# Altium project EIGHT_29.PrjPcb
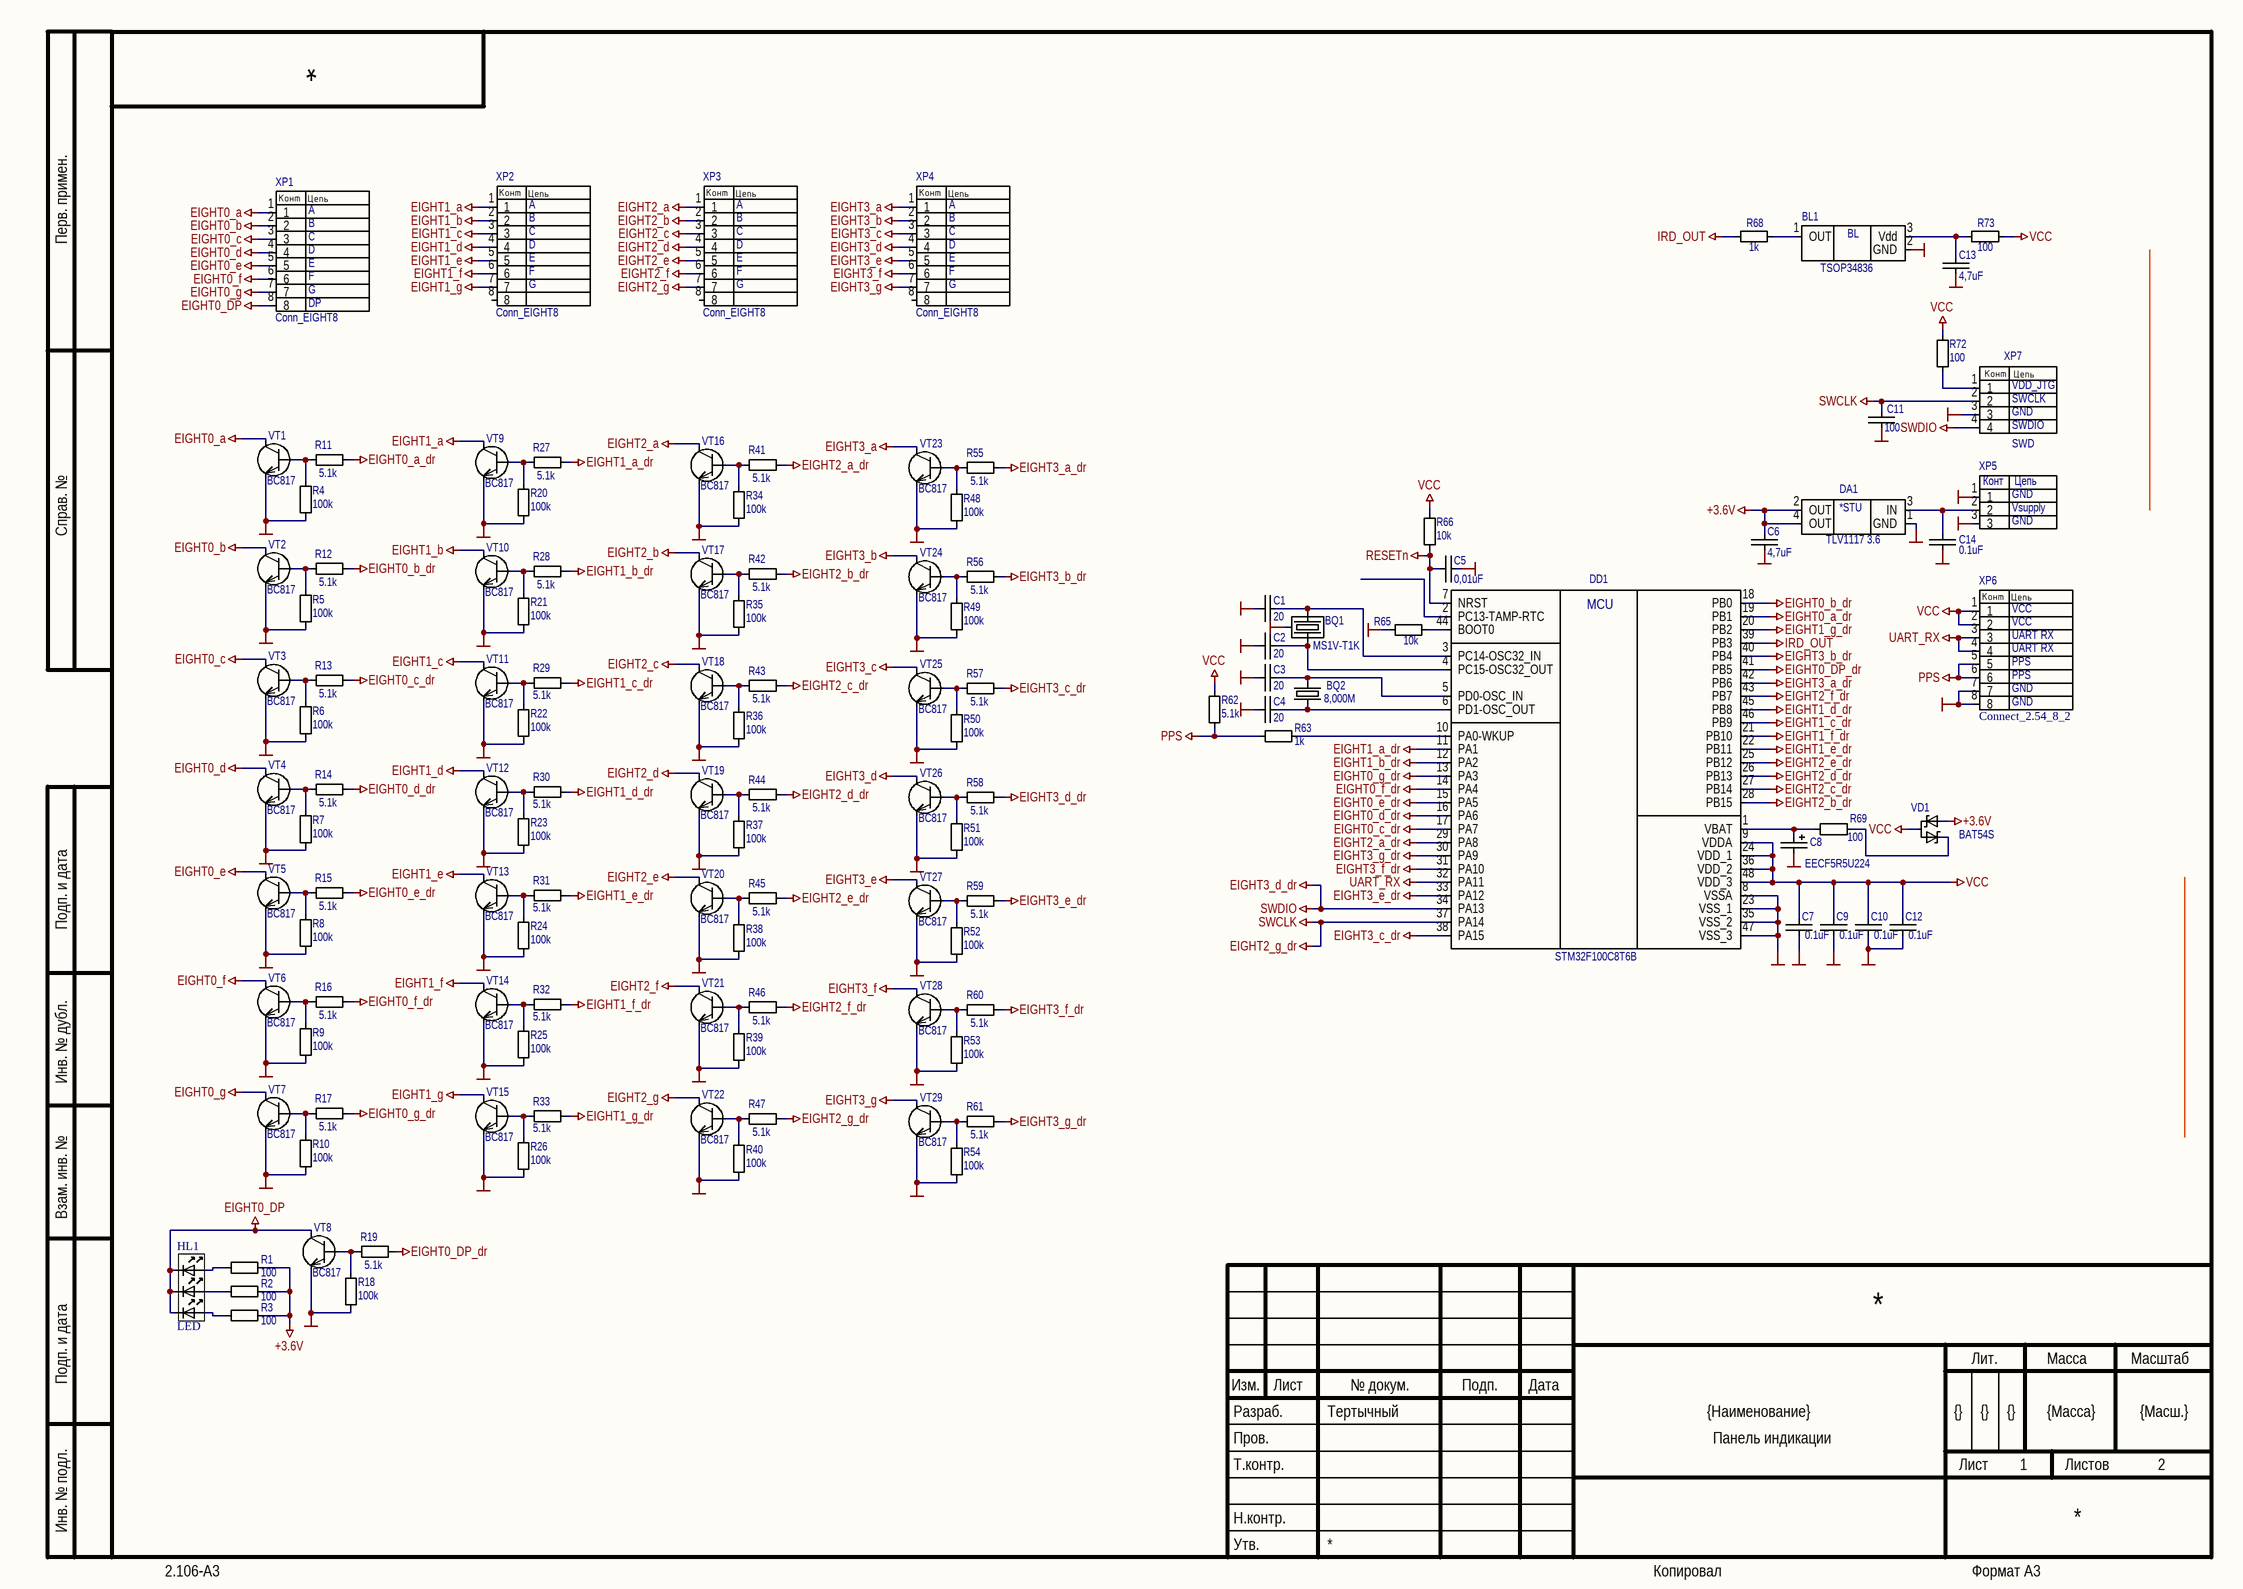
[diagram p0: EIGHT_29.SchDoc]
1 sheet, 126 parts. Net scope: global (net labels, ports and power ports of the same name join across sheets).
Board file: EIGHT_29.PcbDoc

## Sheet EIGHT_29.SchDoc
size 420 x 297 mm; Author: Тертычный; DrawnBy: Тертычный; SheetNumber: 1; SheetTotal: 2; Scale: {Масш.}; Title1str: {Наименование}; PageSetup: Record=PageOptions|CenterHorizontal=False|CenterVertical=False|PrintScale=0.68|XCorrection=0.00|YCorrection=0.00|PrintKind=1|BorderSize=5000000|LeftOffset=0|BottomOffset=0|Orientation=2|PaperLength=1000|PaperWidth=1000|Scale=100|PaperSource=7|PrintQuality=600|MediaType=1|DitherType=10|PrintScaleMode=1|PaperKind=A4; Title2str: {Наименование}; Mass: {Масса}; Letter1Column: {}; Letter2Column: {}; Letter3Column: {}; DocumentType: Панель индикации; DocumentType1str: {Документ}; DocumentType2str: {Документ}

### Parts
BL1  TSOP34836  [TSOP348xx -landed]
BQ1  MS1V-T1K  [Quartz32k]
BQ2  8,000M  [HC 49SM]
C1  20  [Cap_0805]
C2  20  [Cap_0805]
C3  20  [Cap_0805]
C4  20  [Cap_0805]
C5  0,01uF  [Cap_0805]
C6  4,7uF  [Cap_0805]
C7  0.1uF  [CAP_0805]
C8  EECF5R5U224  [EECF5R5U224]
C9  0.1uF  [CAP_0805]
C10  0.1uF  [CAP_0805]
C11  100  [Cap_0805]
C12  0.1uF  [CAP_0805]
C13  4,7uF  [Cap_0805]
C14  0.1uF  [CAP_0805]
DA1  TLV1117 3.6  [SOT223]
DD1  STM32F100C8T6B  [LQFP48]
HL1  LED  [LED5050]
R1  100  [Res_0603]  (net tie)
R2  100  [Res_0603]  (net tie)
R3  100  [Res_0603]  (net tie)
R4  100k  [Res_0603]  (net tie)
R5  100k  [Res_0603]  (net tie)
R6  100k  [Res_0603]  (net tie)
R7  100k  [Res_0603]  (net tie)
R8  100k  [Res_0603]  (net tie)
R9  100k  [Res_0603]  (net tie)
R10  100k  [Res_0603]  (net tie)
R11  5.1k  [Res_0603]  (net tie)
R12  5.1k  [Res_0603]  (net tie)
R13  5.1k  [Res_0603]  (net tie)
R14  5.1k  [Res_0603]  (net tie)
R15  5.1k  [Res_0603]  (net tie)
R16  5.1k  [Res_0603]  (net tie)
R17  5.1k  [Res_0603]  (net tie)
R18  100k  [Res_0603]  (net tie)
R19  5.1k  [Res_0603]  (net tie)
R20  100k  [Res_0603]  (net tie)
R21  100k  [Res_0603]  (net tie)
R22  100k  [Res_0603]  (net tie)
R23  100k  [Res_0603]  (net tie)
R24  100k  [Res_0603]  (net tie)
R25  100k  [Res_0603]  (net tie)
R26  100k  [Res_0603]  (net tie)
R27  5.1k  [Res_0603]  (net tie)
R28  5.1k  [Res_0603]  (net tie)
R29  5.1k  [Res_0603]  (net tie)
R30  5.1k  [Res_0603]  (net tie)
R31  5.1k  [Res_0603]  (net tie)
R32  5.1k  [Res_0603]  (net tie)
R33  5.1k  [Res_0603]  (net tie)
R34  100k  [Res_0603]  (net tie)
R35  100k  [Res_0603]  (net tie)
R36  100k  [Res_0603]  (net tie)
R37  100k  [Res_0603]  (net tie)
R38  100k  [Res_0603]  (net tie)
R39  100k  [Res_0603]  (net tie)
R40  100k  [Res_0603]  (net tie)
R41  5.1k  [Res_0603]  (net tie)
R42  5.1k  [Res_0603]  (net tie)
R43  5.1k  [Res_0603]  (net tie)
R44  5.1k  [Res_0603]  (net tie)
R45  5.1k  [Res_0603]  (net tie)
R46  5.1k  [Res_0603]  (net tie)
R47  5.1k  [Res_0603]  (net tie)
R48  100k  [Res_0603]  (net tie)
R49  100k  [Res_0603]  (net tie)
R50  100k  [Res_0603]  (net tie)
R51  100k  [Res_0603]  (net tie)
R52  100k  [Res_0603]  (net tie)
R53  100k  [Res_0603]  (net tie)
R54  100k  [Res_0603]  (net tie)
R55  5.1k  [Res_0603]  (net tie)
R56  5.1k  [Res_0603]  (net tie)
R57  5.1k  [Res_0603]  (net tie)
R58  5.1k  [Res_0603]  (net tie)
R59  5.1k  [Res_0603]  (net tie)
R60  5.1k  [Res_0603]  (net tie)
R61  5.1k  [Res_0603]  (net tie)
R62  5.1k  [Res_0603]  (net tie)
R63  1k  [Res_0603]  (net tie)
R65  10k  [Res_0603]  (net tie)
R66  10k  [Res_0603]  (net tie)
R68  1k  [Res_0603]  (net tie)
R69  100  [Res_0603]  (net tie)
R72  100  [Res_0603]  (net tie)
R73  100  [Res_0603]  (net tie)
VD1  BAT54S  [SOT-23]
VT1  BC817  [SOT-23]
VT2  BC817  [SOT-23]
VT3  BC817  [SOT-23]
VT4  BC817  [SOT-23]
VT5  BC817  [SOT-23]
VT6  BC817  [SOT-23]
VT7  BC817  [SOT-23]
VT8  BC817  [SOT-23]
VT9  BC817  [SOT-23]
VT10  BC817  [SOT-23]
VT11  BC817  [SOT-23]
VT12  BC817  [SOT-23]
VT13  BC817  [SOT-23]
VT14  BC817  [SOT-23]
VT15  BC817  [SOT-23]
VT16  BC817  [SOT-23]
VT17  BC817  [SOT-23]
VT18  BC817  [SOT-23]
VT19  BC817  [SOT-23]
VT20  BC817  [SOT-23]
VT21  BC817  [SOT-23]
VT22  BC817  [SOT-23]
VT23  BC817  [SOT-23]
VT24  BC817  [SOT-23]
VT25  BC817  [SOT-23]
VT26  BC817  [SOT-23]
VT27  BC817  [SOT-23]
VT28  BC817  [SOT-23]
VT29  BC817  [SOT-23]
XP1  Conn_EIGHT8  [CONN2-8]
XP2  Conn_EIGHT8  [CONN2-8]
XP3  Conn_EIGHT8  [CONN2-8]
XP4  Conn_EIGHT8  [CONN2-8]
XP5  (no value)  [CONN_2.54_3]
XP6  Connect_2.54_8_2  [LEGS8]
XP7  SWD  [CONN_2.54_4]

### Nets
+3.6V: C6.2 DA1.2(OUT) DA1.4(OUT) R1.2 R2.2 R3.2 VD1.1
EIGHT0_a: VT1.3 XP1.1
EIGHT0_a_dr: DD1.19(PB1) R11.1
EIGHT0_b: VT2.3 XP1.2
EIGHT0_b_dr: DD1.18(PB0) R12.1
EIGHT0_c: VT3.3 XP1.3
EIGHT0_c_dr: DD1.17(PA7) R13.1
EIGHT0_d: VT4.3 XP1.4
EIGHT0_d_dr: DD1.16(PA6) R14.1
EIGHT0_DP: HL1.1 HL1.2 HL1.3 VT8.3 XP1.8
EIGHT0_DP_dr: DD1.41(PB5) R19.1
EIGHT0_e: VT5.3 XP1.5
EIGHT0_e_dr: DD1.15(PA5) R15.1
EIGHT0_f: VT6.3 XP1.6
EIGHT0_f_dr: DD1.14(PA4) R16.1
EIGHT0_g: VT7.3 XP1.7
EIGHT0_g_dr: DD1.13(PA3) R17.1
EIGHT1_a: VT9.3 XP2.1
EIGHT1_a_dr: DD1.11(PA1) R27.1
EIGHT1_b: VT10.3 XP2.2
EIGHT1_b_dr: DD1.12(PA2) R28.1
EIGHT1_c: VT11.3 XP2.3
EIGHT1_c_dr: DD1.46(PB9) R29.2
EIGHT1_d: VT12.3 XP2.4
EIGHT1_d_dr: DD1.45(PB8) R30.2
EIGHT1_e: VT13.3 XP2.5
EIGHT1_e_dr: DD1.22(PB11) R31.2
EIGHT1_f: VT14.3 XP2.6
EIGHT1_f_dr: DD1.21(PB10) R32.2
EIGHT1_g: VT15.3 XP2.7
EIGHT1_g_dr: DD1.20(PB2) R33.2
EIGHT2_a: VT16.3 XP3.1
EIGHT2_a_dr: DD1.29(PA8) R41.1
EIGHT2_b: VT17.3 XP3.2
EIGHT2_b_dr: DD1.28(PB15) R42.1
EIGHT2_c: VT18.3 XP3.3
EIGHT2_c_dr: DD1.27(PB14) R43.1
EIGHT2_d: VT19.3 XP3.4
EIGHT2_d_dr: DD1.26(PB13) R44.1
EIGHT2_e: VT20.3 XP3.5
EIGHT2_e_dr: DD1.25(PB12) R45.1
EIGHT2_f: VT21.3 XP3.6
EIGHT2_f_dr: DD1.43(PB7) R46.1
EIGHT2_g: VT22.3 XP3.7
EIGHT2_g_dr: C11.2 DD1.37(PA14) R47.1 XP7.2  [also labelled SWCLK]
EIGHT3_a: VT23.3 XP4.1
EIGHT3_a_dr: DD1.42(PB6) R55.1
EIGHT3_b: VT24.3 XP4.2
EIGHT3_b_dr: DD1.40(PB4) R56.1
EIGHT3_c: VT25.3 XP4.3
EIGHT3_c_dr: DD1.38(PA15) R57.1
EIGHT3_d: VT26.3 XP4.4
EIGHT3_d_dr: DD1.34(PA13) R58.1 XP7.4  [also labelled SWDIO]
EIGHT3_e: VT27.3 XP4.5
EIGHT3_e_dr: DD1.33(PA12) R59.1
EIGHT3_f: VT28.3 XP4.6
EIGHT3_f_dr: DD1.31(PA10) R60.1
EIGHT3_g: VT29.3 XP4.7
EIGHT3_g_dr: DD1.30(PA9) R61.1
GND: BL1.2(GND) BQ1.3 C1.2 C2.2 C3.2 C4.2 C5.1 C6.1 C7.1 C8.2 C9.1 C10.1 C11.1 C12.1 C13.1 C14.1 DA1.1(GND) DD1.8(VSSA) DD1.23(VSS_1) DD1.35(VSS_2) DD1.47(VSS_3) R4.2 R5.2 R6.2 R7.2 R8.2 R9.2 R10.2 R18.2 R20.2 R21.2 R22.2 R23.2 R24.2 R25.2 R26.2 R34.2 R35.2 R36.2 R37.2 R38.2 R39.2 R40.2 R48.2 R49.2 R50.2 R51.2 R52.2 R53.2 R54.2 R65.2 VT1.2 VT2.2 VT3.2 VT4.2 VT5.2 VT6.2 VT7.2 VT8.2 VT9.2 VT10.2 VT11.2 VT12.2 VT13.2 VT14.2 VT15.2 VT16.2 VT17.2 VT18.2 VT19.2 VT20.2 VT21.2 VT22.2 VT23.2 VT24.2 VT25.2 VT26.2 VT27.2 VT28.2 VT29.2 XP5.1 XP5.3 XP6.7 XP6.8 XP7.3
IRD_OUT: DD1.39(PB3) R68.1
PPS: R62.2 R63.1 XP6.5 XP6.6
RESETn: C5.2 DD1.7(NRST) R66.2
UART_RX: DD1.32(PA11) XP6.3 XP6.4
VCC: C7.2 C9.2 C10.2 C12.2 DD1.9(VDDA) DD1.24(VDD_1) DD1.36(VDD_2) DD1.48(VDD_3) R62.1 R66.1 R72.2 R73.2 VD1.3 XP6.1 XP6.2
NetBL1_1: BL1.1(OUT) R68.2
NetBL1_3: BL1.3(Vdd) C13.2 R73.1
NetBQ1_1: BQ1.1 C1.1 DD1.3(PC14-OSC32_IN)
NetBQ1_2: BQ1.2 C2.1 DD1.4(PC15-OSC32_OUT)
NetBQ2_1: BQ2.1 C3.1 DD1.5(PD0-OSC_IN)
NetBQ2_2: BQ2.2 C4.1 DD1.6(PD1-OSC_OUT)
NetC8_1: C8.1 DD1.1(VBAT) R69.2
NetC14_2: C14.2 DA1.3(IN) XP5.2
NetDD1_10: DD1.10(PA0-WKUP) R63.2
NetDD1_44: DD1.44(BOOT0) R65.1
NetHL1_4: HL1.4 R3.1
NetHL1_5: HL1.5 R2.1
NetHL1_6: HL1.6 R1.1
NetR4_1: R4.1 R11.2 VT1.1
NetR5_1: R5.1 R12.2 VT2.1
NetR6_1: R6.1 R13.2 VT3.1
NetR7_1: R7.1 R14.2 VT4.1
NetR8_1: R8.1 R15.2 VT5.1
NetR9_1: R9.1 R16.2 VT6.1
NetR10_1: R10.1 R17.2 VT7.1
NetR18_1: R18.1 R19.2 VT8.1
NetR20_1: R20.1 R27.2 VT9.1
NetR21_1: R21.1 R28.2 VT10.1
NetR22_1: R22.1 R29.1 VT11.1
NetR23_1: R23.1 R30.1 VT12.1
NetR24_1: R24.1 R31.1 VT13.1
NetR25_1: R25.1 R32.1 VT14.1
NetR26_1: R26.1 R33.1 VT15.1
NetR34_1: R34.1 R41.2 VT16.1
NetR35_1: R35.1 R42.2 VT17.1
NetR36_1: R36.1 R43.2 VT18.1
NetR37_1: R37.1 R44.2 VT19.1
NetR38_1: R38.1 R45.2 VT20.1
NetR39_1: R39.1 R46.2 VT21.1
NetR40_1: R40.1 R47.2 VT22.1
NetR48_1: R48.1 R55.2 VT23.1
NetR49_1: R49.1 R56.2 VT24.1
NetR50_1: R50.1 R57.2 VT25.1
NetR51_1: R51.1 R58.2 VT26.1
NetR52_1: R52.1 R59.2 VT27.1
NetR53_1: R53.1 R60.2 VT28.1
NetR54_1: R54.1 R61.2 VT29.1
NetR69_1: R69.1 VD1.2
NetR72_1: R72.1 XP7.1

Not connected (* = marked no-connect by the designer): DD1 2(PC13-TAMP-RTC); XP2 8; XP3 8; XP4 8

### Notes on the sheet
- (near XP1) A
- (near XP1) B
- (near XP1) C
- (near XP1) D
- (near XP2) A
- (near XP2) B
- (near XP2) C
- (near XP2) D
- (near XP2) E
- (near XP3) A
- (near XP3) B
- (near XP3) C
- (near XP3) D
- (near XP3) E
- (near XP4) A
- (near XP4) B
- (near XP4) C
- (near XP4) D
- (near XP4) E
- (near XP1) E
- (near XP1) F
- (near XP1) G
- (near XP1) DP
- (near XP2) F
- (near XP2) G
- (near XP3) F
- (near XP3) G
- (near XP4) F
- (near XP4) G
- (near XP7) VDD_JTG
- (near XP7) SWDIO
- (near XP7) GND
- (near XP7) SWCLK
- (near XP5) Vsupply
- (near XP5) GND
- (near XP6) VCC
- (near XP6) PPS
- (near XP6) UART RX
- (near XP6) GND
- Перв. примен.
- Справ. №
- Подп. и дата
- Инв. № дубл.
- Взам. инв. №
- Разраб.
- Изм.
- Лист
- № докум.
- Подп.
- Дата
- Лит.
- Масса
- Масштаб
- Пров.
- Т.контр.
- Листов
- Инв. № подл.
- Утв.
- Н.контр.
- 2.106-A3
- Копировал
- Формат А3
- (in symbol CONNECT_3) Конт; Цепь
- (in symbol STM32F100C8T6B) MCU
- (in symbol TLV1117) *STU
- (in symbol TSOP348xx_landed) BL

### Library data of the parts
BL1 = TSOP348xx_landed: IR Receiver module; Manufacturer: Vishay; PackageReference: SIP-3; Part Number: TSOP34836; Distributor: http://www.compel.ru; Price: 50.0
BQ1 = MS1V-T1K: MS1V-T1K Quartz 32kHz 6pF; Part Number: MS1V-T1K 32.768kHZ 7pF
BQ2 = BQ_HC 49SM: Crystal oscillator; Manufacturer: STRONG; Part Number: HC49SM-8.000MHZ-20PF; Replacement: HC49SM 8.000M; Value: 8.000M; PackageReference: HC-49SM; Distributor: http://www.rct.ru/; Price: 2.84
C1-C4 = Cap_0805: 20pF 100V 5% NPO; Manufacturer: AVX; Part Number: GRM2165C1H200J; Replacement: 20pF 50V NP0 5% 0805; PackageReference: 0805; Value: 20; Distributor: http://www.chipel.ru/; Price: 0.18
C5 = Cap_0805: 0805 0.01uF 10V X7R 10%; Manufacturer: AVX; Part Number: 08051C103KAT2A; Replacement: 0.01uF 100V X7R 10% 0805; PackageReference: 0805; Value: 0.01uF; Distributor: http://www.chipel.ru/; Price: 0.30
C6 C13 = Cap_0805: 4.7uF 16V X7R 10%; Manufacturer: AVX; Part Number: 0805YC475KAT2A; Replacement: 4.7uF 25V X5R 10% 0805; PackageReference: 0805; Value: 4.7uF; Distributor: http://www.kontest.ru; Price: 9.53
C7 C9 C10 C12 C14 = Cap_0805: PackageReference: 0805; Value: 0.1uF
C8 = EECF5R5U224: Manufacturer: PANASONIC; PackageReference: 5.0 mm; Part Number: EECF5R5U224; Distributor: http://chipdip.ru/; Price: 80
C11 = Cap_0805: 0805 100pF 50V X7R 10%; Manufacturer: AVX; Part Number: 08055C101KAT2A; Replacement: 100pF 50V X7R 10% 0805; PackageReference: 0805; Value: 100; Distributor: http://www.chipel.ru/; Price: 8.00
DA1 = TLV1117: TLV1117-sot223; Manufacturer: Microchip; PackageReference: SOT-223; Part Number: TLV1117; Distributor: http://radel.ru; Price: 20
DD1 = STM32F100C8T6B: ARM Cortex-M3 MCU; Manufacturer: ST; PackageReference: LQFP48; Replacement: -; Part Number: STM32F100C8T6B; Value: -; Distributor: http://rospek.ru/; Price: 50.25
HL1 = LED SMD5050: SMD5050; Manufacturer: DIODES; Price: 3; Distributor: http://www.chipdip.ru/; PackageReference: 5050
R1-R3 R69 R72 R73 = Res_0805: 0805 0.125W 100 Ohms 5%; Manufacturer: Vishay; Part Number: CRCW0805100RJNEA; Replacement: 100 5% 0805 0.125W; Value: 100; PackageReference: 0603; Distributor: http://www.tradeelectronics.ru; Price: 1.00
R4-R10 R18 R20-R26 R34-R40 R48-R54 = Res_0805: 0805, 0.125W, 100 kOhm, 5 %; Manufacturer: Bourns; Part Number: CR0805-JW-104ELF; PackageReference: 0603; Value: 100k; Distributor: http://www.kontest.ru; Price: 0.30
R11-R17 R19 R27-R33 R41-R47 R55-R62 = Res_0805: 0805, 0.125W, 5.1 kOhm, 5 %; Manufacturer: Vishay; Part Number: CRCW0805K10JNTA; Replacement: 5.1k, 5%, 0805, 0.125W; Value: 10k; PackageReference: 0603; Distributor: http://www.kontest.ru; Price: 0.30
R63 = Res_0805: 0805, 0.125W, 1 kOhm, 5 %; Manufacturer: Bourns; Part Number: CR0805-JW-102ELF; PackageReference: 0603; Value: 1k; Distributor: http://www.kontest.ru; Price: 0.30
R65 R66 = Res_0805: 0805, 0.125W, 10 kOhm, 5 %; Manufacturer: Vishay; Part Number: CRCW080510K0JNTA; Replacement: 10k 5% 0805 0.125W; PackageReference: 0603; Value: 10k; Distributor: http://www.kontest.ru; Price: 0.30
R68 = Res_0805: 0805 1k Ohm 5% 0.125W; Manufacturer: Vishay; Part Number: CRCW08051K00JNTA; Replacement: 1k, 5%, 0805, 0.125W; PackageReference: 0603; Value: 1k; Distributor: http://www.kontest.ru; Price: 1.00
VT1-VT29 = NPN_SOT23_DIG_1: BC817 NPN; Manufacturer: Discrete Semiconductors; PackageReference: sot-23; Replacement: -; Part Number: BC817; Value: -; Distributor: http://www.region-virta.ru; Price: 10
XP5 = CONNECT_3
XP6 = Connect_2.54_8_2: Part Number: BH-8
XP7 = CONNECT_SWD: PLS-4; Manufacturer: TRIMMER; PackageReference: PLS-4; Replacement: -; Part Number: PLS-4; Value: -; Distributor: http://www.trimmer.ru/; Price: 0.24
VD1 = BAT54S: Part Number: BAT54S